# Altium schematic sheet MCU_Module.SchDoc: MCU Module
size A3; DocumentNumber: 4; SheetNumber: 4; SheetTotal: 51
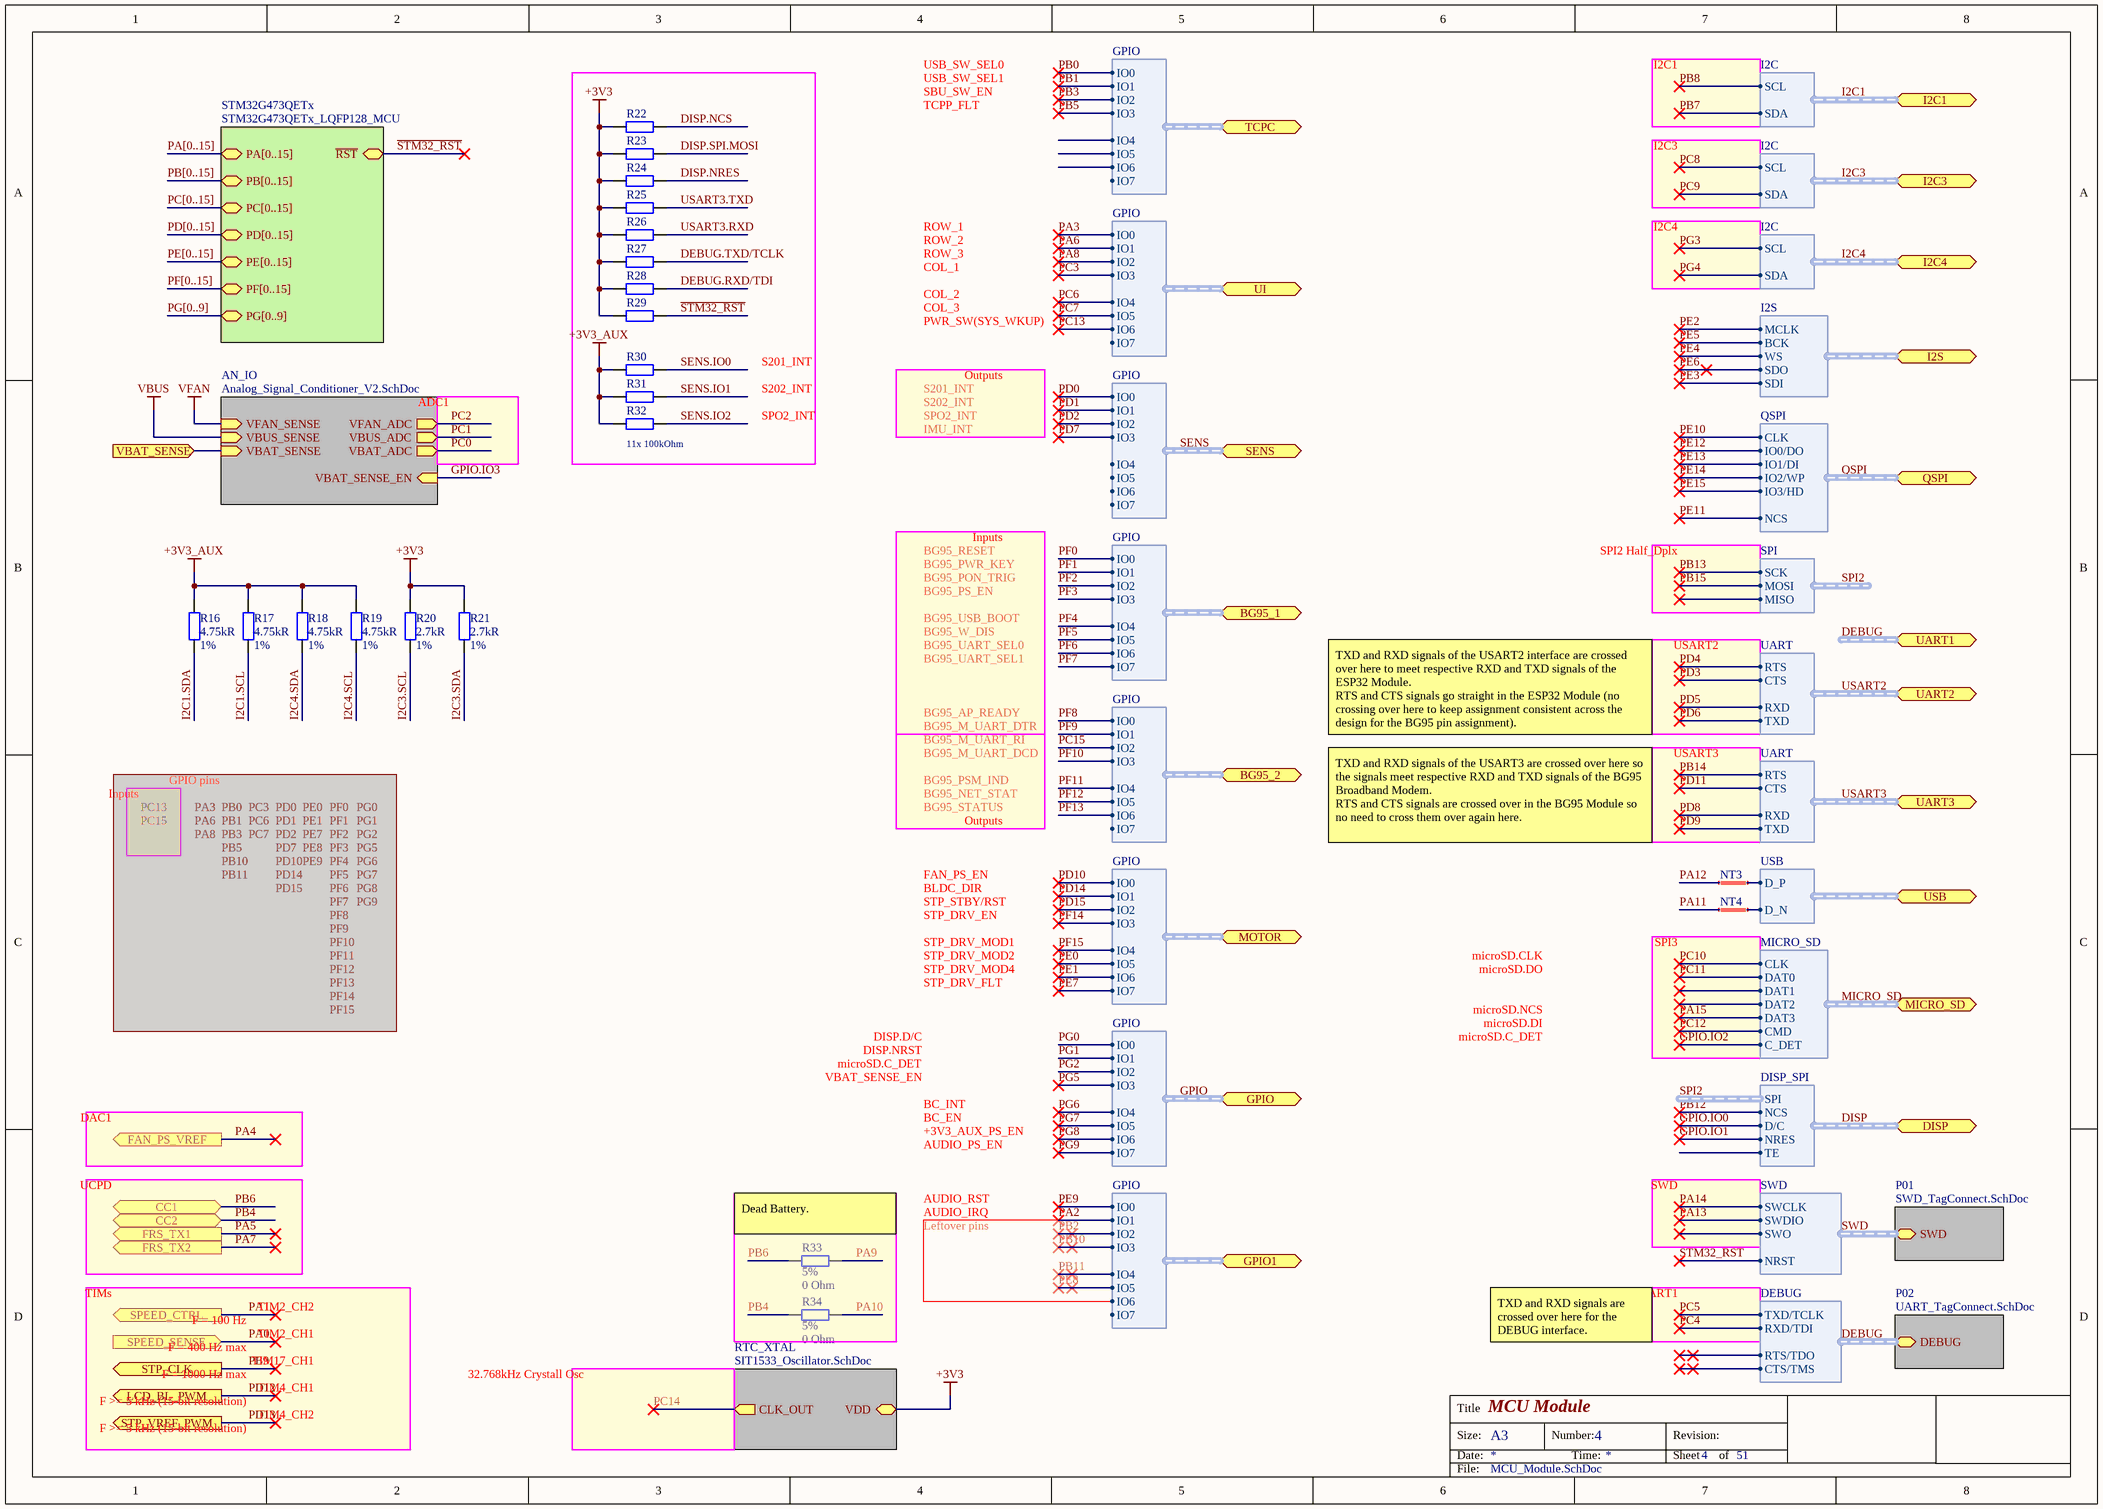
[diagram p0: MCU_Module.SchDoc]

## Parts
NT3  Net Tie  [Net Tie 6x30mil]  (value not drawn)  (net tie, no BOM)
NT4  Net Tie  [Net Tie 6x30mil]  (value not drawn)  (net tie, no BOM)
R16  Resistance: 4.75kR  Tolerance: 1%  [R0402]  (hidden comment: RES SMD 4.75K OHM 1% 1/16W 0402)
R17  Resistance: 4.75kR  Tolerance: 1%  [R0402]  (hidden comment: RES SMD 4.75K OHM 1% 1/16W 0402)
R18  Resistance: 4.75kR  Tolerance: 1%  [R0402]  (hidden comment: RES SMD 4.75K OHM 1% 1/16W 0402)
R19  Resistance: 4.75kR  Tolerance: 1%  [R0402]  (hidden comment: RES SMD 4.75K OHM 1% 1/16W 0402)
R20  Resistance: 2.7kR  Tolerance: 1%  [R0402]  (hidden comment: RES SMD 2.7K OHM 1% 1/16W 0402)
R21  Resistance: 2.7kR  Tolerance: 1%  [R0402]  (hidden comment: RES SMD 2.7K OHM 1% 1/16W 0402)
R22  RES SMD 100K OHM 1% 1/16W 0402  [R0402]  (value not drawn)
R23  RES SMD 100K OHM 1% 1/16W 0402  [R0402]  (value not drawn)
R24  RES SMD 100K OHM 1% 1/16W 0402  [R0402]  (value not drawn)
R25  RES SMD 100K OHM 1% 1/16W 0402  [R0402]  (value not drawn)
R26  RES SMD 100K OHM 1% 1/16W 0402  [R0402]  (value not drawn)
R27  RES SMD 100K OHM 1% 1/16W 0402  [R0402]  (value not drawn)
R28  RES SMD 100K OHM 1% 1/16W 0402  [R0402]  (value not drawn)
R29  RES SMD 100K OHM 1% 1/16W 0402  [R0402]  (value not drawn)
R30  RES SMD 100K OHM 1% 1/16W 0402  [R0402]  (value not drawn)
R31  RES SMD 100K OHM 1% 1/16W 0402  [R0402]  (value not drawn)
R32  RES SMD 100K OHM 1% 1/16W 0402  [R0402]  (value not drawn)
R33  Tolerance: 5%  Resistance: 0 Ohm  [R0402]  (hidden comment: RES SMD 0 OHM JUMPER 1/16W 0402)
R34  Tolerance: 5%  Resistance: 0 Ohm  [R0402]  (hidden comment: RES SMD 0 OHM JUMPER 1/16W 0402)

## Sub-sheets
AN_IO = Analog_Signal_Conditioner_V2.SchDoc: VFAN_SENSE (in), VBUS_SENSE (in), VBAT_SENSE (in), VBAT_ADC (out), VFAN_ADC (out), VBUS_ADC (out), VBAT_SENSE_EN (in)
P01 = SWD_TagConnect.SchDoc: SWD (harness SWD)  | Caption: SWD
P02 = UART_TagConnect.SchDoc: DEBUG (harness DEBUG)  | Caption: DEBUG
RTC_XTAL = SIT1533_Oscillator.SchDoc: CLK_OUT (out), VDD
STM32G473QETx = STM32G473QETx_LQFP128_MCU: ~{RST} (bidir), PA[0..15] (bidir), PB[0..15] (bidir), PC[0..15] (bidir), PF[0..15] (bidir), PD[0..15] (bidir), PE[0..15] (bidir), PG[0..9] (bidir)

## Ports
BG95_1 (harness GPIO), BG95_2 (harness GPIO), CC1 (bidir), CC2 (bidir), DISP (harness DISP_SPI), FAN_PS_VREF (out), FRS_TX1 (out), FRS_TX2 (out), GPIO1 (harness GPIO), GPIO (harness GPIO), I2C1 (harness I2C), I2C3 (harness I2C), I2C4 (harness I2C), I2S (harness I2S), LCD_BL_PWM (out), MICRO_SD (harness MICRO_SD), MOTOR (harness GPIO), QSPI (harness QSPI), SENS (harness GPIO), SPEED_CTRL (out), SPEED_SENSE (in), STP_CLK (out), STP_VREF_PWM (out), TCPC (harness GPIO), UART1 (harness DEBUG), UART2 (harness UART), UART3 (harness UART), UI (harness GPIO), USB (harness USB), VBAT_SENSE (in)

## Harnesses
SWD: SWDIO, SWCLK, NRST, SWO
DEBUG: TXD/TCLK, RXD/TDI, RTS/TDO, CTS/TMS
DISP_SPI: SPI, NCS, D/C, NRES, TE
MICRO_SD: DAT0, DAT1, DAT2, DAT3, CMD, CLK, C_DET
USB: D_P, D_N
SPI: SCK, MISO, MOSI
QSPI: IO0/DO, IO1/DI, NCS, CLK, IO2/WP, IO3/HD
UART: RTS, CTS, RXD, TXD
I2S: WS, SDI, BCK, SDO, MCLK
I2C: SCL, SDA
GPIO: IO0, IO1, IO2, IO3, IO4, IO5, IO6, IO7

## Nets
+3V3: R20.2 R21.2 R22.1 R23.1 R24.1 R25.1 R26.1 R27.1 R28.1 R29.1 ; sheet RTC_XTAL/VDD
+3V3_AUX: R16.2 R17.2 R18.2 R19.2 R30.1 R31.1 R32.1
VBUS: sheet AN_IO/VBUS_SENSE
VFAN: sheet AN_IO/VFAN_SENSE
~{STM32_RST}: R29.2 ; sheet STM32G473QETx/~{RST}, sheet P01/SWD.NRST
DEBUG.RXD/TDI: R28.2
DEBUG.TXD/TCLK: R27.2
DISP.NCS: R22.2
DISP.NRES: R24.2
DISP.SPI.MOSI: R23.2
GPIO.IO0: port DISP.D/C  [project net DISP.D/C]
GPIO.IO1: port DISP.NRES  [project net DISP.NRES]
GPIO.IO2: port MICRO_SD.C_DET
GPIO.IO3: sheet AN_IO/VBAT_SENSE_EN
I2C1.SCL: R17.1
I2C1.SDA: R16.1
I2C3.SCL: R20.1
I2C3.SDA: R21.1
I2C4.SCL: R19.1
I2C4.SDA: R18.1
PA0: port SPEED_SENSE
PA1: port SPEED_CTRL
PA2: port GPIO1.IO1
PA3: port UI.IO0
PA4: port FAN_PS_VREF
PA5: port FRS_TX1
PA6: port UI.IO1
PA7: port FRS_TX2
PA8: port UI.IO2
PA9: R33.2
PA10: R34.2
PA11: NT4.1
PA12: NT3.1
PA13: sheet P01/SWD.SWDIO
PA14: sheet P01/SWD.SWCLK
PA15: port MICRO_SD.DAT3  [project net MICRO_SD.DAT3]
PB0: port TCPC.IO0
PB1: port TCPC.IO1
PB2: port GPIO1.IO2
PB3: port TCPC.IO2
PB4: R34.1 ; port CC2
PB5: port TCPC.IO3
PB6: R33.1 ; port CC1
PB7: port I2C1.SDA  [project net I2C1.SDA]
PB8: port I2C1.SCL  [project net I2C1.SCL]
PB9: port STP_CLK
PB10: port GPIO1.IO3
PB11: port GPIO1.IO4
PB12: port DISP.NCS  [project net DISP.NCS]
PB13: harness SPI.SCK
PB14: port UART3.RTS
PB15: harness SPI.MOSI
PC0: sheet AN_IO/VBAT_ADC
PC1: sheet AN_IO/VBUS_ADC
PC2: sheet AN_IO/VFAN_ADC
PC3: port UI.IO3
PC4: port UART1.RXD/TDI  [project net DEBUG.RXD/TDI]
PC5: port UART1.TXD/TCLK  [project net DEBUG.TXD/TCLK]
PC6: port UI.IO4
PC7: port UI.IO5
PC8: port I2C3.SCL  [project net I2C3.SCL]
PC9: port I2C3.SDA  [project net I2C3.SDA]
PC10: port MICRO_SD.CLK  [project net MICRO_SD.CLK]
PC11: port MICRO_SD.DAT0  [project net MICRO_SD.DAT0]
PC12: port MICRO_SD.CMD  [project net MICRO_SD.CMD]
PC13: port UI.IO6
PC14: sheet RTC_XTAL/CLK_OUT
PC15: port BG95_2.IO2
PD0: port SENS.IO0
PD1: port SENS.IO1
PD2: port SENS.IO2
PD3: port UART2.CTS
PD4: port UART2.RTS
PD5: port UART2.RXD
PD6: port UART2.TXD
PD7: port SENS.IO3
PD8: port UART3.RXD
PD9: port UART3.TXD
PD10: port MOTOR.IO0
PD11: port UART3.CTS
PD12: port LCD_BL_PWM
PD13: port STP_VREF_PWM
PD14: port MOTOR.IO1
PD15: port MOTOR.IO2
PE0: port MOTOR.IO5
PE1: port MOTOR.IO6
PE2: port I2S.MCLK
PE3: port I2S.SDI
PE4: port I2S.WS
PE5: port I2S.BCK
PE6: port I2S.SDO
PE7: port MOTOR.IO7
PE8: port GPIO1.IO5
PE9: port GPIO1.IO0
PE10: port QSPI.CLK
PE11: port QSPI.NCS
PE12: port QSPI.IO0/DO
PE13: port QSPI.IO1/DI
PE14: port QSPI.IO2/WP
PE15: port QSPI.IO3/HD
PF0: port BG95_1.IO0
PF1: port BG95_1.IO1
PF2: port BG95_1.IO2
PF3: port BG95_1.IO3
PF4: port BG95_1.IO4
PF5: port BG95_1.IO5
PF6: port BG95_1.IO6
PF7: port BG95_1.IO7
PF8: port BG95_2.IO0
PF9: port BG95_2.IO1
PF10: port BG95_2.IO3
PF11: port BG95_2.IO4
PF12: port BG95_2.IO5
PF13: port BG95_2.IO6
PF14: port MOTOR.IO3
PF15: port MOTOR.IO4
PG0: port GPIO.IO0  [project net GPIO.IO0]
PG1: port GPIO.IO1  [project net GPIO.IO1]
PG2: port GPIO.IO2  [project net GPIO.IO2]
PG3: port I2C4.SCL  [project net I2C4.SCL]
PG4: port I2C4.SDA  [project net I2C4.SDA]
PG5: port GPIO.IO3  [project net GPIO.IO3]
PG6: port GPIO.IO4  [project net GPIO.IO4]
PG7: port GPIO.IO5  [project net GPIO.IO5]
PG8: port GPIO.IO6  [project net GPIO.IO6]
PG9: port GPIO.IO7  [project net GPIO.IO7]
SENS.IO0: R30.2
SENS.IO1: R31.2
SENS.IO2: R32.2
USART3.RXD: R26.2
USART3.TXD: R25.2
VBAT_SENSE: port VBAT_SENSE, sheet AN_IO/VBAT_SENSE
NetNT3_2: NT3.2 ; port USB.D_P
NetNT4_2: NT4.2 ; port USB.D_N

## Buses and harness runs
bus PA[0..15] = sheet STM32G473QETx/PA[0..15]
bus PB[0..15] = sheet STM32G473QETx/PB[0..15]
bus PC[0..15] = sheet STM32G473QETx/PC[0..15]
bus PD[0..15] = sheet STM32G473QETx/PD[0..15]
bus PE[0..15] = sheet STM32G473QETx/PE[0..15]
bus PF[0..15] = sheet STM32G473QETx/PF[0..15]
bus PG[0..9] = sheet STM32G473QETx/PG[0..9]
harness DEBUG = port UART1
harness DEBUG = sheet P02/DEBUG
harness DISP = port DISP
harness GPIO = port GPIO
harness I2C1 = port I2C1
harness I2C3 = port I2C3
harness I2C4 = port I2C4
harness MICRO_SD = port MICRO_SD
harness QSPI = port QSPI
harness SENS = port SENS
harness SWD = sheet P01/SWD
harness USART2 = port UART2
harness USART3 = port UART3

## Notes on the sheet
- TCPP_FLT
- USB_SW_SEL0
- USB_SW_SEL1
- SBU_SW_EN
- I2C1
- I2C3
- ROW_1
- ROW_2
- I2C4
- ROW_3
- COL_1
- COL_2
- COL_3
- S201_INT
- PWR_SW(SYS_WKUP)
- Outputs
- ADC1
- (near R32) 11x 100kOhm
- S202_INT
- SPO2_INT
- IMU_INT
- BG95_RESET
- BG95_PWR_KEY
- BG95_PON_TRIG
- Inputs
- SPI2 Half_Dplx
- BG95_PS_EN
- BG95_USB_BOOT
- BG95_W_DIS
- BG95_UART_SEL0
- USART2
- BG95_AP_READY
- BG95_UART_SEL1
- GPIO pins
- BG95_PSM_IND
- BG95_M_UART_RI
- BG95_M_UART_DCD
- BG95_M_UART_DTR
- TXD and RXD signals of the USART2 interface are crossed over here to meet respective RXD and TXD signals of the ESP32 Module.
  RTS and CTS signals go straight in the ESP32 Module (no crossing over here to keep assignment consistent across the design for the BG95 pin assignment).
- USART3
- BG95_NET_STAT
- BG95_STATUS
- TXD and RXD signals of the USART3 are crossed over here so the signals meet respective RXD and TXD signals of the BG95 Broadband Modem.
  RTS and CTS signals are crossed over in the BG95 Module so no need to cross them over again here.
- FAN_PS_EN
- BLDC_DIR
- STP_STBY/RST
- STP_DRV_EN
- STP_DRV_MOD1
- STP_DRV_MOD2
- STP_DRV_MOD4
- STP_DRV_FLT
- microSD.CLK
- microSD.DO
- (near NT4) SPI3
- DISP.D/C
- DISP.NRST
- microSD.NCS
- microSD.DI
- microSD.C_DET
- DAC1
- VBAT_SENSE_EN
- BC_INT
- BC_EN
- UCPD
- +3V3_AUX_PS_EN
- AUDIO_PS_EN
- SWD
- (near R33) Dead Battery.
- AUDIO_RST
- AUDIO_IRQ
- Leftover pins
- TIMs
- F = 100 Hz
- TIM2_CH2
- USART1
- F = 400 Hz max
- F = 1000 Hz max
- TIM17_CH1
- TIM4_CH1
- TIM2_CH1
- 32.768kHz Crystall Osc
- TXD and RXD signals are crossed over here for the DEBUG interface.
- F >= 5 kHz (15-bit resolution)
- TIM4_CH2
- Title
- Size:
- Date:
- A3
- Number:
- Time:
- Revision:
- Sheet
- of
- File:

## Library data of the parts
NT3 NT4 = Net Tie Line: ClassName: STM32G473CETx
R16-R19 = RES SMD 4.75K OHM 1% 1/16W 0402: 4.75 kOhms ±1% 0.063W, 1/16W Chip Resistor 0402 (1005 Metric) Moisture Resistant Thick Film; Manufacturer: Yageo; Manufacturer Part Number: RC0402FR-074K75P; Max Power Dissipation: 63mW; Temperature Coefficient: 150ppm/°C; Case/Package: 0402; Supplier 1: Digi-Key; Stock 1: 23485; Pricing 1: 1=0.1, 10=0.035, 100=0.014, 1000=0.0063, 2500=0.0055, 5000=0.0045 (USD); Case Code (Metric): 1005; Case Code (Imperial): 0402; Min Operating Temperature: -55°C; Max Operating Temperature: 155°C; Packaging: Tape and Reel; Composition: Thick Film; Number of Terminations: 2; Features: Moisture Resistant; Length: 0.039inch; Height: 0.016inch; Width: 0.02inch; ComponentLink1URL: http://www.yageo.com/NewPortal/yageodocoutput?fileName=/pdf/R-Chip/PYu-RC_51_RoHS_P_0.pdf&src-supplier=Digi-Key; ComponentLink1Description: http://www.yageo.com/NewPortal/yageodocoutput?fileName=/pdf/R-Chip/PYu-RC_51_RoHS_P_0.pdf&src-supplier=Digi-Key; ComponentLink2URL: http://www.yageo.com.tw/exep/pages/download/literatures/PYu-R_INT-thick_7.pdf?src-supplier=Digi-Key; ComponentLink2Description: http://www.yageo.com.tw/exep/pages/download/literatures/PYu-R_INT-thick_7.pdf?src-supplier=Digi-Key; Supplier Part Number 1: YAG1271CT-ND; ClassName: I2C_SW; Mount: Surface Mount
R20 R21 = RES SMD 2.7K OHM 1% 1/16W 0402: 2.7 kOhms ±1% 0.063W, 1/16W Chip Resistor 0402 (1005 Metric) Moisture Resistant Thick Film; Manufacturer: Yageo; Manufacturer Part Number: RC0402FR-072K7L; Power Rating: 63mW; Temperature Coefficient: 100ppm/°C; Voltage Rating: 50V; Supplier 1: Digi-Key; Stock 1: 261850; Pricing 1: 1=0.1, 10=0.016, 100=0.0064, 1000=0.0029, 2500=0.0025, 5000=0.0021 (USD); Case/Package: 0402; Case Code (Imperial): 0402; Case Code (Metric): 1005; Min Operating Temperature: -55°C; Max Operating Temperature: 155°C; Packaging: Tape and Reel; Package Quantity: 1; Termination: SMD/SMT; Composition: Thick Film; Number of Terminations: 2; Military Standard: Not; Max Power Dissipation: 63mW; Features: Moisture Resistant; Working Voltage: 50V; Length: 1mm; Height: 0.016inch; Width: 0.02inch; Depth: 0.5mm; REACH SVHC: Unknown; Lead Free: Lead Free; ComponentLink1URL: http://www.mouser.com/ds/2/447/PYu-RC0402_51_RoHS_L_6_r-8721.pdf?src-supplier=Mouser; ComponentLink1Description: http://www.mouser.com/ds/2/447/PYu-RC0402_51_RoHS_L_6_r-8721.pdf?src-supplier=Mouser; ComponentLink2URL: http://www.yageo.com/documents/recent/PYu-RC_Group_51_RoHS_L_9.pdf?src-supplier=Digi-Key; ComponentLink2Description: http://www.yageo.com/documents/recent/PYu-RC_Group_51_RoHS_L_9.pdf?src-supplier=Digi-Key; ComponentLink3URL: http://www.yageo.com/documents/recent/PYu-RC_Group_51_RoHS_L_10.pdf?src-supplier=Digi-Key; ComponentLink3Description: http://www.yageo.com/documents/recent/PYu-RC_Group_51_RoHS_L_10.pdf?src-supplier=Digi-Key; ComponentLink4URL: http://www.farnell.com/datasheets/2167052.pdf?src-supplier=Element14; ComponentLink4Description: http://www.farnell.com/datasheets/2167052.pdf?src-supplier=Element14; Supplier Part Number 1: 311-2.70KLRCT-ND; ClassName: STM32G473CETx; Mount: Surface Mount
R22-R32 = RES SMD 100K OHM 1% 1/16W 0402: 100 kOhms ±1% 0.063W, 1/16W Chip Resistor 0402 (1005 Metric) Moisture Resistant Thick Film; Manufacturer: Yageo; Manufacturer Part Number: RC0402FR-07100KL; Temperature Coefficient: 100ppm/°C; Power Rating: 63mW; Voltage Rating: 50V; Supplier 1: Digi-Key; Stock 1: 47448883; Pricing 1: 1=0.1, 10=0.016, 100=0.0064, 1000=0.0029, 2500=0.0025, 5000=0.0021 (USD); Case Code (Metric): 1005; Case Code (Imperial): 0402; Min Operating Temperature: -55°C; Max Operating Temperature: 155°C; Composition: Thick Film; Packaging: Tape and Reel; Termination: SMD/SMT; Military Standard: Not; Length: 0.039inch; Height: 0.016inch; Width: 0.02inch; Depth: 0.5mm; Lead Free: Lead Free; ComponentLink1URL: http://www.yageo.com/documents/recent/PYu-RC_Group_51_RoHS_L_10.pdf?src-supplier=Digi-Key; ComponentLink1Description: http://www.yageo.com/documents/recent/PYu-RC_Group_51_RoHS_L_10.pdf?src-supplier=Digi-Key; ComponentLink2URL: http://www.farnell.com/datasheets/1018594.pdf?src-supplier=Element14; ComponentLink2Description: http://www.farnell.com/datasheets/1018594.pdf?src-supplier=Element14; ComponentLink3URL: http://www.yageo.com/documents/recent/PYu-RC_Group_51_RoHS_L_9.pdf?src-supplier=Verical; ComponentLink3Description: http://www.yageo.com/documents/recent/PYu-RC_Group_51_RoHS_L_9.pdf?src-supplier=Verical; Supplier Part Number 1: 311-100KLRDKR-ND; Case/Package: 0402; Tolerance: 1%; Resistance: 100 kOhm; Package Quantity: 1; Number of Terminations: 2; Max Power Dissipation: 63mW; Working Voltage: 50V; Features: Moisture Resistant; REACH SVHC: No SVHC; ComponentLink4URL: http://www.yageo.com/documents/recent/PYu-RC_Group_51_RoHS_L_9.pdf?src-supplier=Mouser; ComponentLink4Description: http://www.yageo.com/documents/recent/PYu-RC_Group_51_RoHS_L_9.pdf?src-supplier=Mouser; ComponentLink5URL: http://documents.rs-components.com/techlib://itc_doclist_GB.htm?stockno=6185797&src-supplier=RSComponents; ComponentLink5Description: http://documents.rs-components.com/techlib://itc_doclist_GB.htm?stockno=6185797&src-supplier=RSComponents; Mount: Surface Mount
R33 R34 = RES SMD 0 OHM JUMPER 1/16W 0402: 0 Ohms Jumper 0.063W, 1/16W Chip Resistor 0402 (1005 Metric) Moisture Resistant Thick Film; Manufacturer: Yageo; Manufacturer Part Number: RC0402JR-070RL; Power Rating: 62.5mW; Voltage Rating: 50V; Max Power Dissipation: 63mW; Temperature Coefficient: 200ppm/°C; Case/Package: 0402; Supplier 1: Digi-Key; Stock 1: 46057148; Pricing 1: 1=0.1, 10=0.013, 25=0.0092, 50=0.0072, 100=0.0053, 250=0.004, 500=0.0032, 1000=0.0024, 5000=0.0017 (USD); Contact Plating: Tin,Matte; Case Code (Metric): 1005; Case Code (Imperial): 0402; Min Operating Temperature: -55°C; Max Operating Temperature: 155°C; Packaging: Tape and Reel; Composition: Thick Film; Package Quantity: 1; Number of Terminations: 2; Termination: SMD/SMT; Military Standard: Not; Features: Moisture Resistant; Length: 1mm; Height: 0.016inch; Width: 0.02inch; Depth: 0.5mm; Radiation Hardening: No; REACH SVHC: Unknown; Lead Free: Lead Free; ComponentLink1URL: http://www.yageo.com/documents/recent/PYu-RC_Group_51_RoHS_L_10.pdf?src-supplier=Digi-Key; ComponentLink1Description: http://www.yageo.com/documents/recent/PYu-RC_Group_51_RoHS_L_10.pdf?src-supplier=Digi-Key; ComponentLink2URL: http://www.yageo.com/documents/recent/PYu-RC0402_51_RoHS_L_6.pdf?src-supplier=Avnet+Europe; ComponentLink2Description: http://www.yageo.com/documents/recent/PYu-RC0402_51_RoHS_L_6.pdf?src-supplier=Avnet+Europe; ComponentLink3URL: http://www.farnell.com/datasheets/1018594.pdf?src-supplier=Element14; ComponentLink3Description: http://www.farnell.com/datasheets/1018594.pdf?src-supplier=Element14; ComponentLink4URL: https://www.verical.com/server-webapp/html/getDatasheet?partID=326379&src-supplier=Verical; ComponentLink4Description: https://www.verical.com/server-webapp/html/getDatasheet?partID=326379&src-supplier=Verical; ComponentLink5URL: http://www.farnell.com/datasheets/2167052.pdf?src-supplier=Element14; ComponentLink5Description: http://www.farnell.com/datasheets/2167052.pdf?src-supplier=Element14; Supplier Part Number 1: 311-0.0JRCT-ND; ClassName: STM32G473CETx; Mount: Surface Mount